# EAGLE design cmoy-wide2 (EAGLE 6.5.0)
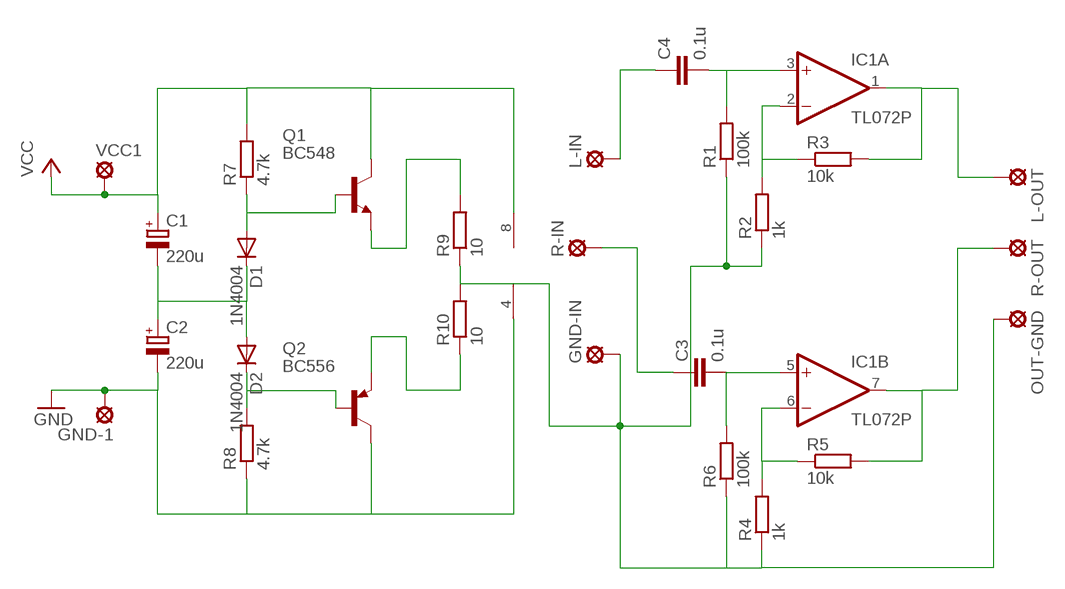
[diagram p0: schematic, sheet 1]

## Parts
C1  220u  CPOL-EUE2.5-6  [E2,5-6]
C2  220u  CPOL-EUE2.5-6  [E2,5-6]
C3  0.1u  C-EU075-042X103  [C075-042X103]
C4  0.1u  C-EU075-042X103  [C075-042X103]
D1  1N4004  [DO41-10]
D2  1N4004  [DO41-10]
GND-1  LSP10  [LSP10]
GND-IN  LSP10  [LSP10]
IC1  TL072P  [DIL08]
L-IN  LSP10  [LSP10]
L-OUT  LSP10  [LSP10]
OUT-GND  LSP10  [LSP10]
Q1  BC548  [TO92-EBC]
Q2  BC556  [TO92-EBC]
R1  100k  R-EU_0207/10  [0207/10]
R2  1k  R-EU_0207/10  [0207/10]
R3  10k  R-EU_0207/10  [0207/10]
R4  1k  R-EU_0207/10  [0207/10]
R5  10k  R-EU_0207/10  [0207/10]
R6  100k  R-EU_0207/10  [0207/10]
R7  4.7k  R-EU_0207/10  [0207/10]
R8  4.7k  R-EU_0207/10  [0207/10]
R9  10  R-EU_0207/10  [0207/10]
R10  10  R-EU_0207/10  [0207/10]
R-IN  LSP10  [LSP10]
R-OUT  LSP10  [LSP10]
VCC1  LSP10  [LSP10]

## Nets
GND: C2.- GND-1.MP IC1.4(P:V-) Q2.C R8.1
N$2: C1.- C2.+ D1.C D2.A
N$3: D2.C Q2.B R8.2
N$5: D1.A Q1.B R7.1
N$8: GND-IN.MP OUT-GND.MP R1.1 R2.1 R4.1 R6.1 R9.1 R10.2
N$9: Q1.E R9.2
N$10: Q2.E R10.1
N$11: IC1.2(A:-IN) R2.2 R3.1
N$12: IC1.1(A:OUT) L-OUT.MP R3.2
N$13: C4.2 IC1.3(A:+IN) R1.2
N$14: C4.1 L-IN.MP
N$16: IC1.7(B:OUT) R5.2 R-OUT.MP
N$17: IC1.6(B:-IN) R4.2 R5.1
N$18: C3.2 IC1.5(B:+IN) R6.2
N$19: C3.1 R-IN.MP
VCC: C1.+ IC1.8(P:V+) Q1.C R7.2 VCC1.MP

## Library data of the parts
C1 C2 = resistor:CPOL-EU: POLARIZED CAPACITOR, European symbol
C3 C4 = resistor:C-EU: CAPACITOR, European symbol
D1 D2 = diode:1N4004: DIODE general purpose rectifier, 1 A
GND-1 GND-IN L-IN L-OUT OUT-GND R-IN R-OUT VCC1 = solpad:LSP10: SOLDER PAD drill 1.0 mm, distributor Buerklin, 12H555
IC1 = linear:TL072: OP AMP
Q1 = transistor-npn:BC548*: NPN Transistor
Q2 = transistor-pnp:BC556*: PNP Transistror
R1-R8 = rcl:R-EU_: RESISTOR, European symbol
R9 R10 = resistor:R-EU_: RESISTOR, European symbol

## Board
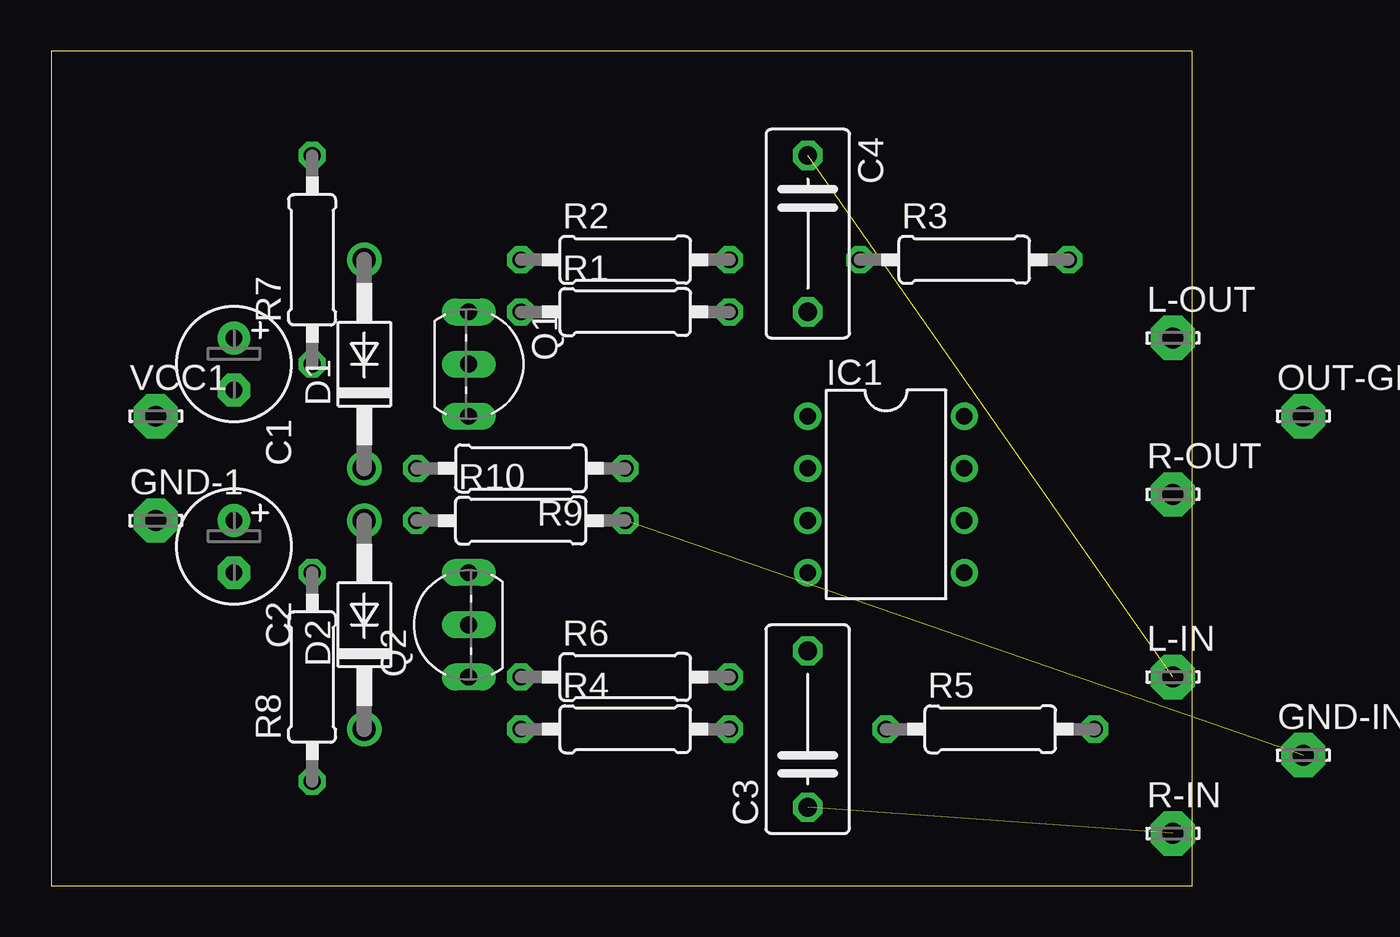
[diagram p1: board, top side]
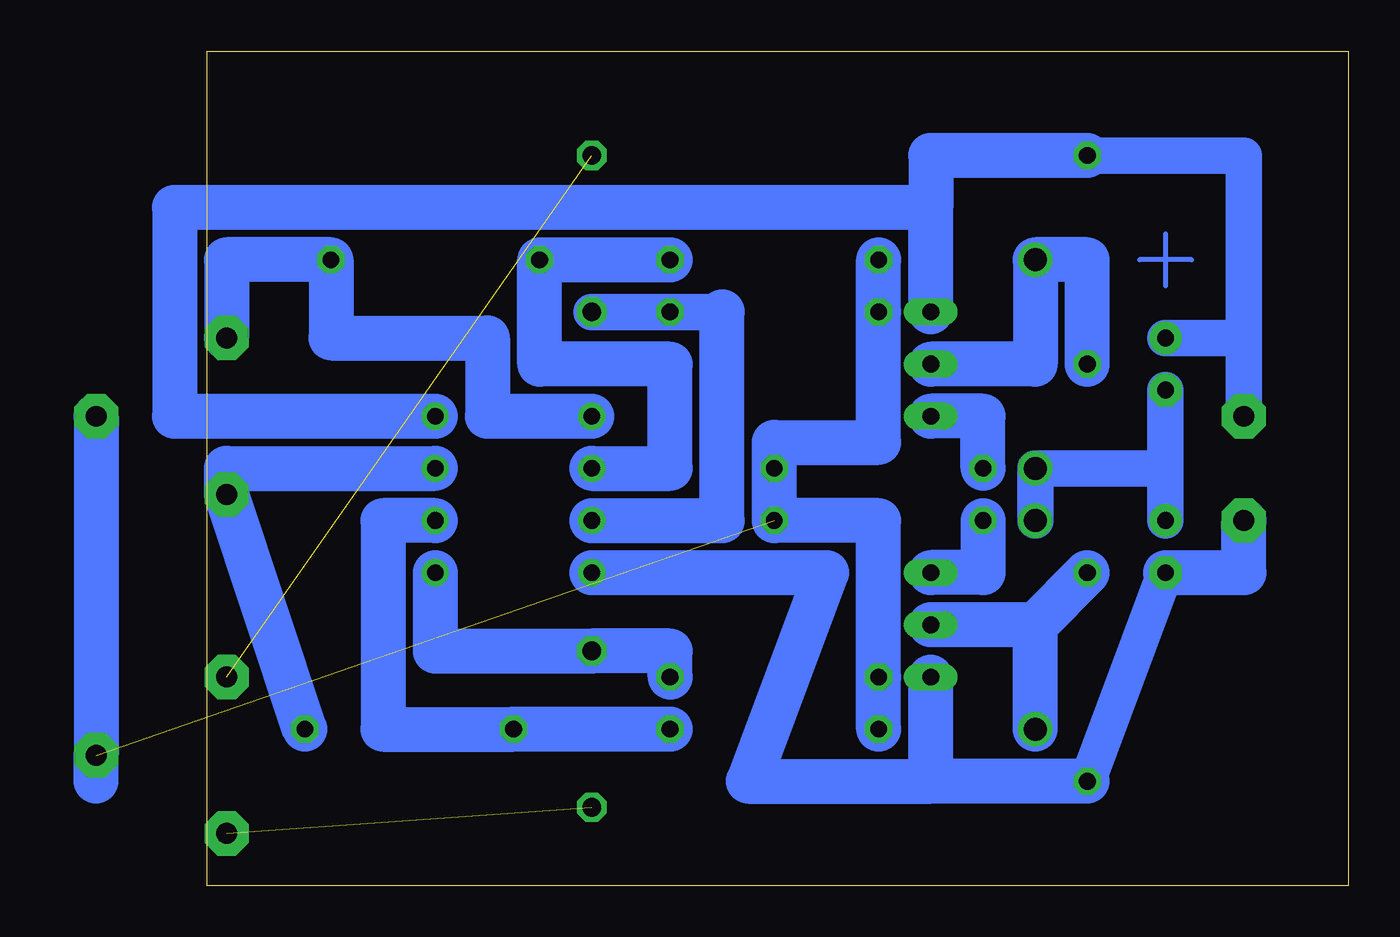
[diagram p2: board, bottom side, seen from below]

Size 55.55 x 40.63 mm. Coordinates in mm from the lower left corner, seen from the top.
Outline: 0,0 55.55,0 55.55,40.63 0,40.63 0,0
Copper layers (1*16): Top 0.035mm / dielectric 1.5mm / Bottom 0.035mm
Design rules "default *": minimum track width 10mil, minimum drill 24mil, track to track 8mil, track to pad 8mil, pad to pad 8mil, via to via 8mil, smd to smd 8mil, copper to edge 40mil, drill to drill 8mil, minimum pad ring 10mil, minimum via ring 8mil, stop-mask expansion 4mil, vias tented up to drill 0mil, thermal gap 10mil

### Footprints (pad centres in the part's own frame; a part is rotated, then mirrored left to right if it is on the bottom)
E2,5-6 = drill 0.813 pad 1.6: + -1.27,0 | drill 0.813 pad 1.6 octagon: - 1.27,0
C075-042X103 = drill 0.914 octagon: 1 -3.81,0; 2 3.81,0
DO41-10 = drill 1.118: A 5.08,0; C -5.08,0
LSP10 = drill 1.016 pad 2.159 octagon: MP 0,0
DIL08 = drill 0.813 pad 1.27: 1 -3.81,-3.81; 2 -1.27,-3.81; 3 1.27,-3.81; 4 3.81,-3.81; 5 3.81,3.81; 6 1.27,3.81; 7 -1.27,3.81; 8 -3.81,3.81
TO92-EBC = drill 0.813 long: B 0,-1.27; C -2.54,-1.27; E 2.54,-1.27
0207/10 = drill 0.813 octagon: 1 -5.08,0; 2 5.08,0

### Placement (x,y rotation side)
C1  8.89,25.4 270 top
C2  8.89,16.51 270 top
C3  36.83,7.62 90 top
C4  36.83,31.75 270 top
D1  15.24,25.4 90 top
D2  15.24,12.7 90 top
GND-1  5.08,17.78 0 top
GND-IN  60.96,6.35 0 top  (outside the outline)
IC1  40.64,19.05 270 top
L-IN  54.61,10.16 0 top
L-OUT  54.61,26.67 0 top
OUT-GND  60.96,22.86 0 top  (outside the outline)
Q1  21.59,25.4 270 top
Q2  19.05,12.7 90 top
R1  27.94,27.94 0 top
R2  27.94,30.48 0 top
R3  44.45,30.48 0 top
R4  27.94,7.62 0 top
R5  45.72,7.62 0 top
R6  27.94,10.16 0 top
R7  12.7,30.48 90 top
R8  12.7,10.16 90 top
R9  22.86,20.32 180 top
R10  22.86,17.78 0 top
R-IN  54.61,2.54 0 top
R-OUT  54.61,19.05 0 top
VCC1  5.08,22.86 0 top

### Tracks (layer width: path | path; a pad name or v marks a point on that pad's centre or on a via)
GND
  Bottom 1.778: C2.- R8.1
  Bottom 2.184: IC1.4 25.4,15.24 29.21,5.08 20.32,5.08 | 20.32,5.08 Q2.C | R8.1 20.32,5.08 | C2.- 5.08,15.24 GND-1.MP
N$2
  Bottom 1.778: D2.A D1.C 8.89,20.32 | 8.89,20.32 C2.+ | C1.- 8.89,20.32
N$3
  Bottom 2.184: R8.2 15.24,12.7 | D2.C 15.24,12.7 | 15.24,12.7 Q2.B
N$5
  Bottom 2.184: R7.1 12.7,30.48 D1.A 15.24,25.4 Q1.B
N$6
  Bottom 0.25: 8.89,31.75 8.89,29.21
N$7
  Bottom 0.25: 7.62,30.48 10.16,30.48
N$8  (1 unrouted)
  Bottom 2.184: R4.1 R6.1 22.86,17.78 R10.2 R9.1 27.94,21.59 22.86,21.59 R1.1 R2.1 | 60.96,5.08 GND-IN.MP OUT-GND.MP
N$9
  Bottom 2.184: R9.2 17.78,22.86 Q1.E
N$10
  Bottom 2.184: R10.1 17.78,15.24 Q2.E
N$11
  Bottom 2.184: R2.2 R3.1 39.37,25.4 33.02,25.4 33.02,20.32 IC1.2
N$12
  Bottom 2.184: L-OUT.MP 54.61,30.48 R3.2 49.53,26.67 41.91,26.67 41.91,22.86 IC1.1
N$13
  Bottom 1.778: C4.2 R1.2 30.48,27.94
  Bottom 2.184: IC1.3 30.48,17.78 30.48,27.94
N$14  (1 unrouted)
N$16
  Bottom 2.184: R5.2 R-OUT.MP 54.61,20.32 IC1.7
N$17
  Bottom 2.184: R4.2 R5.1 46.99,7.62 46.99,17.78 IC1.6
N$18
  Bottom 2.184: IC1.5 44.45,11.43 C3.2 33.02,11.43 R6.2
N$19  (1 unrouted)
VCC
  Bottom 1.778: 5.08,26.67 5.08,35.56 R7.2 | C1.+ 5.08,26.67 | VCC1.MP 5.08,26.67
  Bottom 2.184: R7.2 20.32,35.56 20.32,33.02 | Q1.C 20.32,33.02 | 20.32,33.02 57.15,33.02 57.15,22.86 IC1.8